# Altium schematic sheet Power.SchDoc: Power & Interfacing
size A4; PageSetup: Record=PageOptions|CenterHorizontal=True|CenterVertical=True|PrintScale=0.97|XCorrection=1.00|YCorrection=1.00|PrintKind=0|BorderSize=5000000|LeftOffset=0|BottomOffset=0|Orientation=2|PaperLength=1000|PaperWidth=1000|Scale=100|PaperSource=7|PrintQuality=-3|MediaType=1|DitherType=10|PrintScaleMode=1|PaperKind=A4|PaperIndex=9
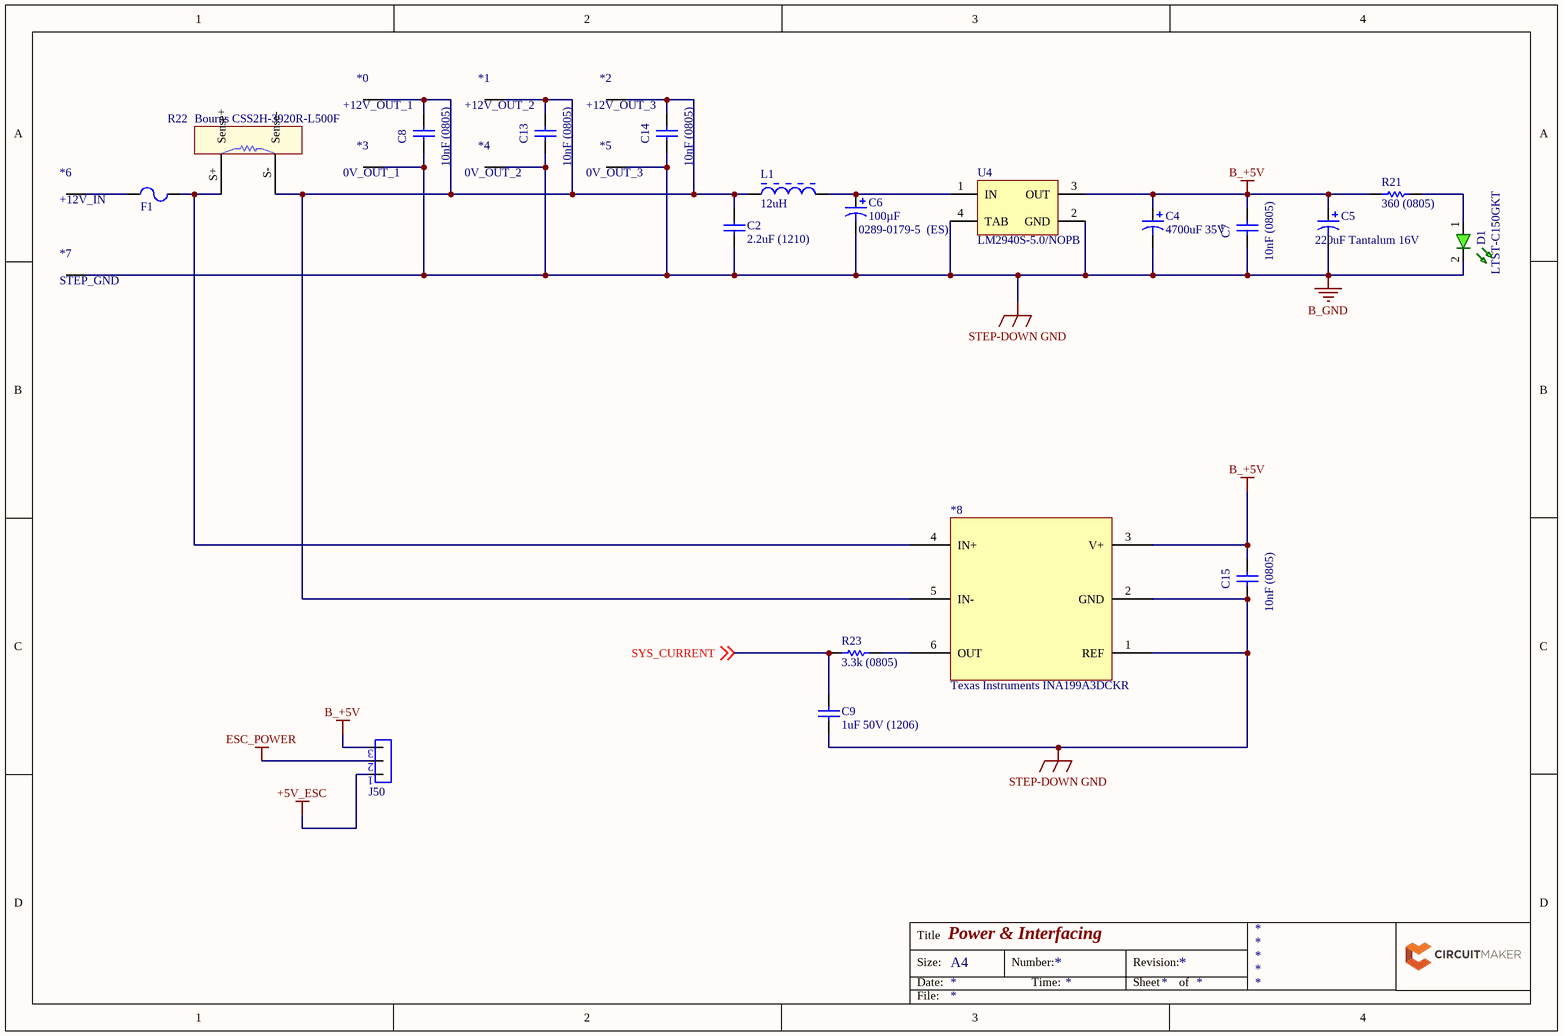
[diagram p0: Power.SchDoc]

## Parts
*0  +12V_OUT_1  [PCB-pcj1l6roq5gpi9u538ps-1]
*1  +12V_OUT_2  [PCB-pcj1l6roq5gpi9u538ps-1]
*2  +12V_OUT_3  [PCB-pcj1l6roq5gpi9u538ps-1]
*3  0V_OUT_1  [PCB-pcj1l6roq5gpi9u538ps-1]
*4  0V_OUT_2  [PCB-pcj1l6roq5gpi9u538ps-1]
*5  0V_OUT_3  [PCB-pcj1l6roq5gpi9u538ps-1]
*6  +12V_IN  [PCB-pcj1l6roq5gpi9u538ps-1]
*7  STEP_GND  [PCB-pcj1l6roq5gpi9u538ps-1]
*8  Texas Instruments INA199A3DCKR  [PCB-77zgin3zajz1p7ole171-1]
C2  2.2uF (1210)  [PCB-2fbb0vau3p468w0y920g-1]
C4  4700uF 35V  [PCB-uagykt4yf5hbq2so0sas-1]
C5  220uF Tantalum 16V  [PCB-fa1e6qpy6fbu77u2ye0h-1]
C6  100µF  OctopartID: 0289-0179-5  (ES)  [PCB-ec5i0bi6g8n3i6bd77c9-1]
C7  10nF (0805)  [CAPC2013X94X50NL20T25]
C8  10nF (0805)  [CAPC2013X94X50NL20T25]
C9  1uF 50V (1206)  [CAPC3216X180X55NL20T25]
C13  10nF (0805)  [CAPC2013X94X50NL20T25]
C14  10nF (0805)  [CAPC2013X94X50NL20T25]
C15  10nF (0805)  [CAPC2013X94X50NL20T25]
D1  Manufacturer Part Number: LTST-C150GKT  [PCB-ol758qabjjwuqvqjb2k1-1]  (hidden comment: Lite-On LTST-C150GKT)
F1  Keystone 3544-2  [PCB-p3yqezitk9kmwwp2mp00-1]  (value not drawn)
J50  TE Connectivity / AMP 5-146274-3  [PCB-m19gj7kkh000buv4lmik-1]  (value not drawn)
L1  12uH  [BOUR-SDR0403-2_V]
R21  360 (0805)  [RESC2013X60X40NL15T20]
R22  Bourns CSS2H-3920R-L500F  [PCB-p7sd064g1v6dorbgawsb-1]
R23  3.3k (0805)  [RESC2013X60X40NL15T20]
U4  LM2940S-5.0/NOPB  [TS3B_L]

## Nets
+5V_ESC: J50.1
B_+5V: *8.3(V+) C4.1 C5.1 C7.2 C15.2 J50.3 R21.1 U4.3(OUT)
B_GND: *3.0 *4.0 *5.0 *7.0 *8.1(REF) *8.2(GND) C2.1 C4.2 C5.2 C6.2 C7.1 C8.1 C9.1 C13.1 C14.1 C15.1 D1.2(K) U4.2(GND) U4.4(TAB)  [also labelled STEP-DOWN GND]
ESC_POWER: J50.2
SYS_CURRENT: C9.2 R23.2 ; off-sheet SYS_CURRENT
Net*0_0: *0.0 *1.0 *2.0 *8.5(IN-) C2.2 C8.2 C13.2 C14.2 L1.1 R22.S-(Sense-)
Net*6_0: *6.0 F1.1
Net*8_4: *8.4(IN+) F1.2 R22.S+(Sense+)
Net*8_6: *8.6(OUT) R23.1
NetC6_1: C6.1 L1.2 U4.1(IN)
NetD1_1: D1.1(A) R21.2

## Notes on the sheet
- Title
- Size:
- Date:
- A4
- Number:
- Time:
- Revision:
- Sheet
- of
- File:

## Library data of the parts
*0-*7 = CMP-5ddc94dc62be821b-2: Standoff; 12 mm; M3 x 0.5; Brass; Hex; Nickel Plate; 8 in.; 8 in.; Manufacturer Part Number: 24314; Lead-Free Status: Lead Free; Size-Width: 5.00 mm; Octopart URL: http://octopart.com/24314-keystone-662020; OctopartID: 5ddc94dc62be821b; Size-Length: 12.0 mm; Material: Brass; RoHS: Compliant
*8 = CMP-6ab6a2a7a250b571-1: 26-V, Bi-Directional, Zero-Drift, Low- or High-Side, Voltage Output Current Shunt Monitor 6-SC70 -40 to 125; Lead-Free Status: Lead Free; Octopart URL: http://octopart.com/ina199a3dckr-texas+instruments-18607488; Manufacturer Part Number: INA199A3DCKR; Lifecycle Status: Active; RoHS: Compliant; OctopartID: 6ab6a2a7a250b571
C2 = Murata GRM32ER71H475KA88L-1: 1210 4.7 uF 50 V ±10% Tolerance X7R SMT Multilayer Ceramic Capacitor; Voltage Rating (DC): 50.0 V; Lead-Free Status: Lead Free; Capacitance: 4.7e-06 F; Case/Package (SI): 3225; Octopart URL: http://octopart.com/grm32er71h475ka88l-murata-196576; Manufacturer Part Number: GRM32ER71H475KA88L; Size-Height: 0.0025 m; Dielectric Characteristic: X7R; Size-Width: 0.0025 m; RoHS: Compliant; REACH SVHC Compliance: No SVHC; Mounting Style: Surface Mount; Capacitance Tolerance: ±10%; Packaging: Cut Tape (CT), Tape & Reel (TR); Size-Length: 0.0032 m; Size-Thickness: 0.0025 m; Lifecycle Status: Active; Case/Package: 1210; Number of Pins: 2; OctopartID: 8d884480570e524f
C4 = CMP-4cda85d37137931d-1: 18mm x 40mm l/s=7.5mm 105deg 4700uf 35v Radial Leads Lesr Aluminum Electrolytic Cap; Manufacturer Part Number: UPW1V472MHD; Voltage Rating (DC): 35.0 V; Lead-Free Status: Lead Free; Capacitance: 0.0047 F; Equivalent Series Resistance (ESR): 0.028 ?; Capacitance Tolerance: ±20%; Octopart URL: http://octopart.com/upw1v472mhd-nichicon-202891; Size-Length: 0.04 m; Size-Height: 0.04 m; RoHS: Compliant; Mounting Style: Through Hole; Dielectric Material: Aluminum Electrolytic; Packaging: Bulk; Size-Diameter: 0.018 m; OctopartID: 4cda85d37137931d
C5 = CMP-d5771c7fde4f0ab0-1: Kemet T491E227K016AT Cap Tant Solid 220uF 16V E CASE 10% (7.3 X 6 X 3.6mm) SMD 7260-38 0.9 Ohm 125C Automotive T/R; Voltage Rating (DC): 16.0 V; Lead-Free Status: Lead Free; Equivalent Series Resistance (ESR): 900 m?; Capacitance: 220 µF; Octopart URL: http://octopart.com/t491e227k016at-kemet-142942; Manufacturer Part Number: T491E227K016AT; Case/Package: 7260-38; Size-Width: 6.00 mm; RoHS: Compliant; Mounting Style: Surface Mount; Dielectric Material: Tantalum; Packaging: Cut Tape (CT), Tape & Reel (TR); Size-Length: 7.30 mm; Size-Height: 3.60 mm; Capacitance Tolerance: ±10%; Number of Pins: 2; OctopartID: d5771c7fde4f0ab0
C6 = CMP-42da8bd37ecc9d1d-1: WX Series 100 uF 25 V ±20 % Surface Mount Chip Aluminum Electrolytic Capacitor; Capacitance Tolerance: ±20%; Voltage Rating (DC): 25.0 V; Size-Height: 5.40 mm; Dielectric Material: Aluminum Electrolytic; Size-Diameter: 8.00 mm
C7 C8 C13-C15 = CMP-16466678-5: CAP CER 10NF 50V 5% X7R 0805; Manufacturer Part Number: 08055C103JAT2A; Case/Package (SI): 2012; Capacitance: 1e-08 F; Voltage Rating (DC): 50.0 V; Dielectric Material: Ceramic Multilayer; Lead-Free Status: Lead Free; Insulation Resistance: 1e+11 ?; Size-Width: 0.0012446 m; REACH SVHC Compliance: No SVHC; Capacitance Tolerance: ±5%; Case/Package: 0805; Mounting Style: Surface Mount; Size-Thickness: 0.0009398 m; Dielectric Characteristic: X7R; Octopart Url: https://octopart.com/08055c103jat2a-avx+interconnect+%2F+elco-39513106; Size-Height: 0.00094 m; Size-Length: 0.0020066 m; Number of Pins: 2; RoHS: Compliant; OctopartID: 02fac9aacb8edd3d
C9 = CMP-121173-2: CAP CER 1UF 50V 10% X7R 1206; Capacitance: 1e-06 F; Case/Package (SI): 3216; Lead-Free Status: Lead Free; Voltage Rating (DC): 50.0 V; Capacitance Tolerance: ±10%; Dielectric Characteristic: X7R; Lifecycle Status: Active; Mounting Style: Surface Mount; Octopart Url: https://octopart.com/grm31cr71h105ka61l-murata-197460; OctopartID: 26d9efd000ebf91e; REACH SVHC Compliance: No SVHC; RoHS: Compliant; Size-Length: 0.0032 m; Size-Thickness: 0.0016 m; Size-Width: 0.0016 m
D1 = CMP-d7361e3491ff08f1-2: Green 3.2 x 1.6 x 1.1 mm 130° Water Clear 6 mcd 2.1 V Chip LED Surface Mount; Lead-Free Status: Lead Free; Case/Package (SI): 3216; Luminous Intensity: 6.00 mcd; Forward Voltage: 2.10 V; Lens Type: Non-Diffused; Wavelength: 565 nm; Manufacturer: LITE-ON; Color: Green; RoHS: Compliant; Size-Length: 3.20 mm; Case/Package: 1206; OctopartID: d7361e3491ff08f1; Octopart URL: http://octopart.com/ltst-c150gkt-lite-on-549807; Size-Height: 1.10 mm; Packaging: Tape & Reel (TR); Viewing Angle: 130 °; Mounting Style: Surface Mount, Vertical; Size-Width: 1.60 mm
F1 = CMP-54019d0b3e378bc6-3: Fuse Clip; 500 VAC; 30 A; PCB; For 0.110 in. x 0.032 in. mini blade fuses; Voltage Rating (DC): 500 V; Color: Black; Lead-Free Status: Lead Free; Current Rating: 30.0 A; Number of Circuits: 1; Octopart URL: http://octopart.com/3544-2-keystone-20304; Contact Plating: Brass; Voltage Rating (AC): 500 V; Size-Height: 8.70 mm; Size-Width: 4.76 mm; Packaging: Bulk; RoHS: Compliant; Mounting Style: PCB, Snap-In; Flammability Rating: UL 94 V-0; OctopartID: 54019d0b3e378bc6; REACH SVHC Compliance: No SVHC; Contact Material: Brass; Manufacturer Part Number: 3544-2; Lifecycle Status: Not Listed by Manufacturer; Size-Length: 14.7 mm
J50 = CMP-740dbf71fd8babca-9: AMPMODU 3 Position 2.54 mm Single Row Through-Hole Straight Breakaway Header; ELV Compliant: Compliant; Number of Contacts: 3; Gender: Male; Lead-Free Status: Lead Free; Manufacturer Part Number: 5-146274-3; Octopart URL: http://octopart.com/5-146274-3-te+connectivity+%2F+amp-41331936; Mounting Style: PCB; Contact Material: Phosphor Bronze; Lifecycle Status: Active; Housing Color: Black; OctopartID: 740dbf71fd8babca; RoHS: Compliant; Orientation: Vertical; Flammability Rating: UL 94 V-0; Contact Plating: Tin, Tin over Nickel
L1 = CMP-911394-2: SDR0403 Series Power Inductor, 12 uF +/- 20 %, 0.21 Ohm, -40 to 125 degC, 2-Pin SMD, RoHS, Tape and Reel; Inductance: 1.2e-05 H; Q-Factor: 28.0; Octopart Url: https://octopart.com/sdr0403-120ml-bourns-1990149; OctopartID: 7b20b2340043a4e7; Packaging: Cut Tape (CT); REACH SVHC Compliance: No SVHC; RoHS: Compliant
R21 R23 = CMP-1860549-2: RES SMD 10K OHM 1% 1/3W 0805; Lead-Free Status: Lead Free; Power Rating: 0.125 W; Resistance: 10000.0 ?; Voltage Rating (DC): 150.0 V; Case/Package: 0805; Mounting Style: Surface Mount; Number of Pins: 2; Octopart Url: https://octopart.com/crcw080510k0fkeahp-vishay-42634554; OctopartID: fa6931e9523525ae; Packaging: Cut Tape (CT); REACH SVHC Compliance: No SVHC; Resistance Tolerance: ±1%; RoHS: Compliant
R22 = CMP-5a03976e567885c4-2: Res Metal Strip 3920 0.0005 Ohm 1% 9W ±50ppm/C Pad SMD Automotive T/R; Resistance: 500 µ?; Power Rating: 9.00 W; Manufacturer Part Number: CSS2H-3920R-L500F; OctopartID: 5a03976e567885c4; Packaging: Cut Tape (CT); Octopart URL: http://octopart.com/css2h-3920r-l500f-bourns-73869597; Resistance Tolerance: ±1%; RoHS: Compliant
U4 = CMP-0062-00588-3: 1A Low Dropout Regulator, 3-pin TO-263, Pb-Free; Current Rating: 1.0 A; Dropout Voltage: 0.5 V; Lead-Free Status: Contains Lead; Number of Outputs: 1; Output Capacitor Type: Tantalum; Output Voltage: 5.0 V; Quiescent Current: 0.01 A; Lifecycle Status: Active; Mounting Style: Surface Mount; Number of Pins: 3; Number of Regulated Outputs: 1; Octopart Url: https://octopart.com/lm2940s-5.0%2Fnopb-texas+instruments-24813565; OctopartID: 84f94c893e625b3e; Output Current: 1.0 A; Packaging: Tube; REACH SVHC Compliance: No SVHC; RoHS: Non-Compliant